# Altium schematic sheet STM32F407.SchDoc
size A4; SheetNumber: 1; SheetTotal: 4
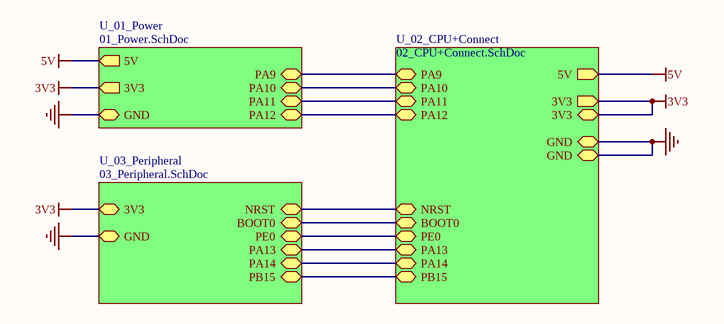
[diagram p0: STM32F407.SchDoc]

## Sub-sheets
U_01_Power = 01_Power.SchDoc: 3V3 (out), GND (bidir), PA9 (bidir), PA10 (bidir), PA11 (bidir), PA12 (bidir), 5V (out)
U_02_CPU+Connect = 02_CPU+Connect.SchDoc: 3V3 (bidir), GND (bidir), NRST (bidir), PB15 (bidir), BOOT0 (bidir), PE0 (bidir), PA13 (bidir), PA14 (bidir), 3V3 (out), GND (bidir), PA9 (bidir), PA10 (bidir), PA11 (bidir), PA12 (bidir), 5V (out)
U_03_Peripheral = 03_Peripheral.SchDoc: 3V3 (bidir), GND (bidir), NRST (bidir), PB15 (bidir), BOOT0 (bidir), PE0 (bidir), PA13 (bidir), PA14 (bidir)

## Nets
3V3: sheet U_01_Power/3V3, sheet U_02_CPU+Connect/3V3, sheet U_02_CPU+Connect/3V3, sheet U_03_Peripheral/3V3
5V: sheet U_01_Power/5V, sheet U_02_CPU+Connect/5V
GND: sheet U_01_Power/GND, sheet U_02_CPU+Connect/GND, sheet U_02_CPU+Connect/GND, sheet U_03_Peripheral/GND
(unnamed): sheet U_01_Power/PA9, sheet U_02_CPU+Connect/PA9
(unnamed): sheet U_01_Power/PA10, sheet U_02_CPU+Connect/PA10
(unnamed): sheet U_01_Power/PA11, sheet U_02_CPU+Connect/PA11
(unnamed): sheet U_01_Power/PA12, sheet U_02_CPU+Connect/PA12
(unnamed): sheet U_02_CPU+Connect/NRST, sheet U_03_Peripheral/NRST
(unnamed): sheet U_02_CPU+Connect/PB15, sheet U_03_Peripheral/PB15
(unnamed): sheet U_02_CPU+Connect/BOOT0, sheet U_03_Peripheral/BOOT0
(unnamed): sheet U_02_CPU+Connect/PE0, sheet U_03_Peripheral/PE0
(unnamed): sheet U_02_CPU+Connect/PA13, sheet U_03_Peripheral/PA13
(unnamed): sheet U_02_CPU+Connect/PA14, sheet U_03_Peripheral/PA14